# Altium project STEERING_WHEEL_SWITCHES.PrjPcb
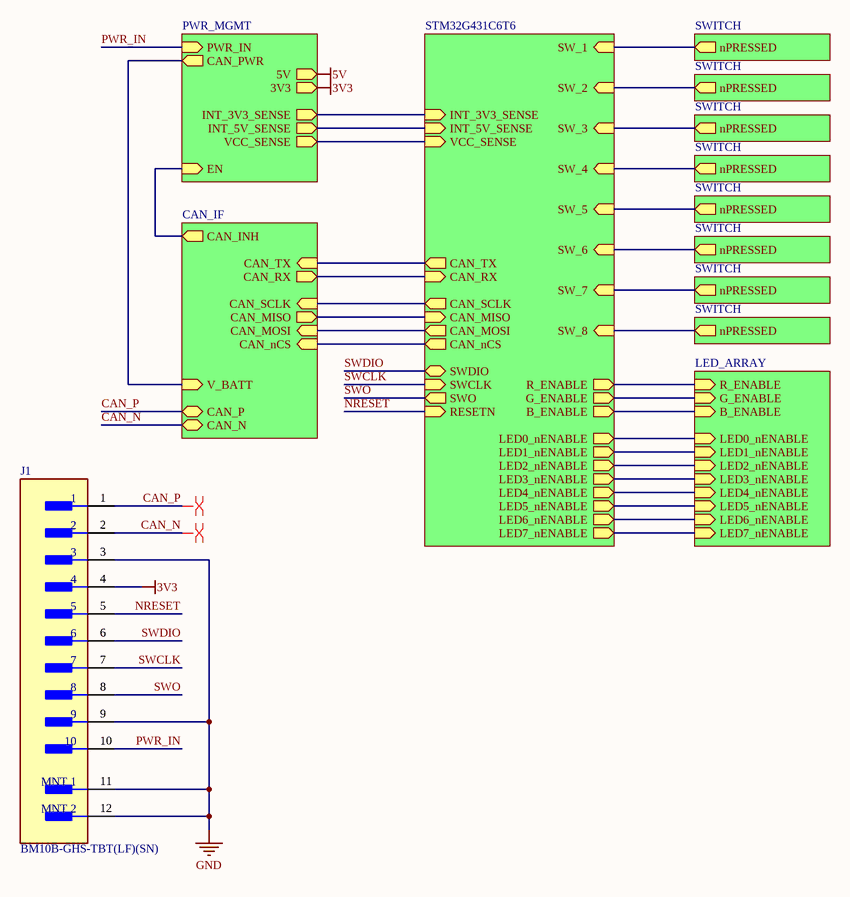
[diagram p0: STEERING_WHEEL_SWITCHES.SchDoc]
2 sheets, 20 parts. Net scope: hierarchical (ports join the sheet entries above them; power ports are global).
Board files: SWS_LEFT.PcbDoc, SWS_RIGHT.PcbDoc
Sheets:
  STEERING_WHEEL_SWITCHES.SchDoc
    PWR_MGMT = PWR_MGMT.SchDoc

## Sheet STEERING_WHEEL_SWITCHES.SchDoc
size A4; SheetNumber: 1; SheetTotal: 6

### Parts
J1  BM10B-GHS-TBT(LF)(SN)  [FP-BM10B-GHS-TBT_LF_SN-MFG]

### Sub-sheets
CAN_IF = CAN_IF (file not in this document): CAN_TX (in), CAN_RX (out), CAN_SCLK (in), CAN_MISO (out), CAN_MOSI (in), CAN_nCS (in), CAN_INH (out), CAN_P (bidir), CAN_N (bidir), V_BATT (in)
LED_ARRAY = LED_ARRAY (file not in this document): R_ENABLE (in), G_ENABLE (in), B_ENABLE (in), LED0_nENABLE (in), LED1_nENABLE (in), LED2_nENABLE (in), LED3_nENABLE (in), LED4_nENABLE (in), LED5_nENABLE (in), LED6_nENABLE (in), LED7_nENABLE (in)
MCU = STM32G431C6T6 (file not in this document): SW_1 (in), SW_2 (in), SW_3 (in), SW_4 (in), SW_5 (in), SW_6 (in), SW_7 (in), SW_8 (in), INT_3V3_SENSE (in), INT_5V_SENSE (in), CAN_TX (out), CAN_RX (in), CAN_SCLK (out), CAN_MISO (in), CAN_MOSI (out), CAN_nCS (out), SWDIO (bidir), SWCLK (in), SWO (out), RESETN (in), R_ENABLE (out), G_ENABLE (out), B_ENABLE (out), LED0_nENABLE (out), LED1_nENABLE (out), LED2_nENABLE (out), LED3_nENABLE (out), LED4_nENABLE (out), LED5_nENABLE (out), LED6_nENABLE (out), LED7_nENABLE (out), VCC_SENSE (in)
PWR_MGMT = PWR_MGMT: PWR_IN (in), EN (in), 5V (out), 3V3 (out), INT_3V3_SENSE (out), INT_5V_SENSE (out), CAN_PWR (out), VCC_SENSE (out)
SWITCH = SWITCH (file not in this document): nPRESSED (out)
SWITCH = SWITCH (file not in this document): nPRESSED (out)
SWITCH = SWITCH (file not in this document): nPRESSED (out)
SWITCH = SWITCH (file not in this document): nPRESSED (out)
SWITCH = SWITCH (file not in this document): nPRESSED (out)
SWITCH = SWITCH (file not in this document): nPRESSED (out)
SWITCH = SWITCH (file not in this document): nPRESSED (out)
SWITCH = SWITCH (file not in this document): nPRESSED (out)

### Nets
3V3: J1.4 ; sheet PWR_MGMT/3V3
GND: J1.3 J1.9 J1.11(MNT_1) J1.12(MNT_2)
CAN_N: J1.2 ; sheet CAN_IF/CAN_N
CAN_P: J1.1 ; sheet CAN_IF/CAN_P
NRESET: J1.5 ; sheet MCU/RESETN
PWR_IN: J1.10 ; sheet PWR_MGMT/PWR_IN
SWCLK: J1.7 ; sheet MCU/SWCLK
SWDIO: J1.6 ; sheet MCU/SWDIO
SWO: J1.8 ; sheet MCU/SWO
V_BATT: sheet PWR_MGMT/CAN_PWR, sheet CAN_IF/V_BATT
NetR1_1: sheet PWR_MGMT/VCC_SENSE, sheet MCU/VCC_SENSE
NetR7_1: sheet PWR_MGMT/INT_3V3_SENSE, sheet MCU/INT_3V3_SENSE
NetR11_1: sheet PWR_MGMT/INT_5V_SENSE, sheet MCU/INT_5V_SENSE
NetR12_2: sheet PWR_MGMT/EN, sheet CAN_IF/CAN_INH
(unnamed): sheet MCU/SW_1, sheet SWITCH/nPRESSED
(unnamed): sheet MCU/SW_2, sheet SWITCH/nPRESSED
(unnamed): sheet MCU/SW_3, sheet SWITCH/nPRESSED
(unnamed): sheet MCU/SW_4, sheet SWITCH/nPRESSED
(unnamed): sheet MCU/SW_5, sheet SWITCH/nPRESSED
(unnamed): sheet MCU/SW_6, sheet SWITCH/nPRESSED
(unnamed): sheet MCU/SW_7, sheet SWITCH/nPRESSED
(unnamed): sheet MCU/SW_8, sheet SWITCH/nPRESSED
(unnamed): sheet MCU/CAN_TX, sheet CAN_IF/CAN_TX
(unnamed): sheet MCU/CAN_RX, sheet CAN_IF/CAN_RX
(unnamed): sheet MCU/CAN_SCLK, sheet CAN_IF/CAN_SCLK
(unnamed): sheet MCU/CAN_MISO, sheet CAN_IF/CAN_MISO
(unnamed): sheet MCU/CAN_MOSI, sheet CAN_IF/CAN_MOSI
(unnamed): sheet MCU/CAN_nCS, sheet CAN_IF/CAN_nCS
(unnamed): sheet MCU/R_ENABLE, sheet LED_ARRAY/R_ENABLE
(unnamed): sheet MCU/G_ENABLE, sheet LED_ARRAY/G_ENABLE
(unnamed): sheet MCU/B_ENABLE, sheet LED_ARRAY/B_ENABLE
(unnamed): sheet MCU/LED0_nENABLE, sheet LED_ARRAY/LED0_nENABLE
(unnamed): sheet MCU/LED1_nENABLE, sheet LED_ARRAY/LED1_nENABLE
(unnamed): sheet MCU/LED2_nENABLE, sheet LED_ARRAY/LED2_nENABLE
(unnamed): sheet MCU/LED3_nENABLE, sheet LED_ARRAY/LED3_nENABLE
(unnamed): sheet MCU/LED4_nENABLE, sheet LED_ARRAY/LED4_nENABLE
(unnamed): sheet MCU/LED5_nENABLE, sheet LED_ARRAY/LED5_nENABLE
(unnamed): sheet MCU/LED6_nENABLE, sheet LED_ARRAY/LED6_nENABLE
(unnamed): sheet MCU/LED7_nENABLE, sheet LED_ARRAY/LED7_nENABLE

### Layout directives
differential pair: CAN_N, CAN_P

### Library data of the parts
J1 = CMP-17439-000185-1: Connector Header Surface Mount 10 position 0.049" (1.25mm); Current Rating: 1A; Number of Contacts: 10; Voltage Rating: 50V; Wire/Cable Gauge: 26AWG; Connector Type: Male Pin; Packaging: Tape and Reel; Lead Free: Lead Free; Contact Material: Bronze; Termination: SMD/SMT; Orientation: Straight; Package Quantity: 1; Color: Natural; Housing Material: Nylon; Mount: Surface Mount; Fastening Type: Latch; REACH SVHC: No SVHC; Number of Rows: 1; Series: GH; Voltage Rating (AC): 50V; Number of Positions: 10; Min Operating Temperature: -25°C; Housing Color: Natural; Max Operating Temperature: 85°C; Contact Plating: Tin; Pitch: 1.25mm

## Sheet PWR_MGMT.SchDoc
size A4; SheetNumber: 3; SheetTotal: 6
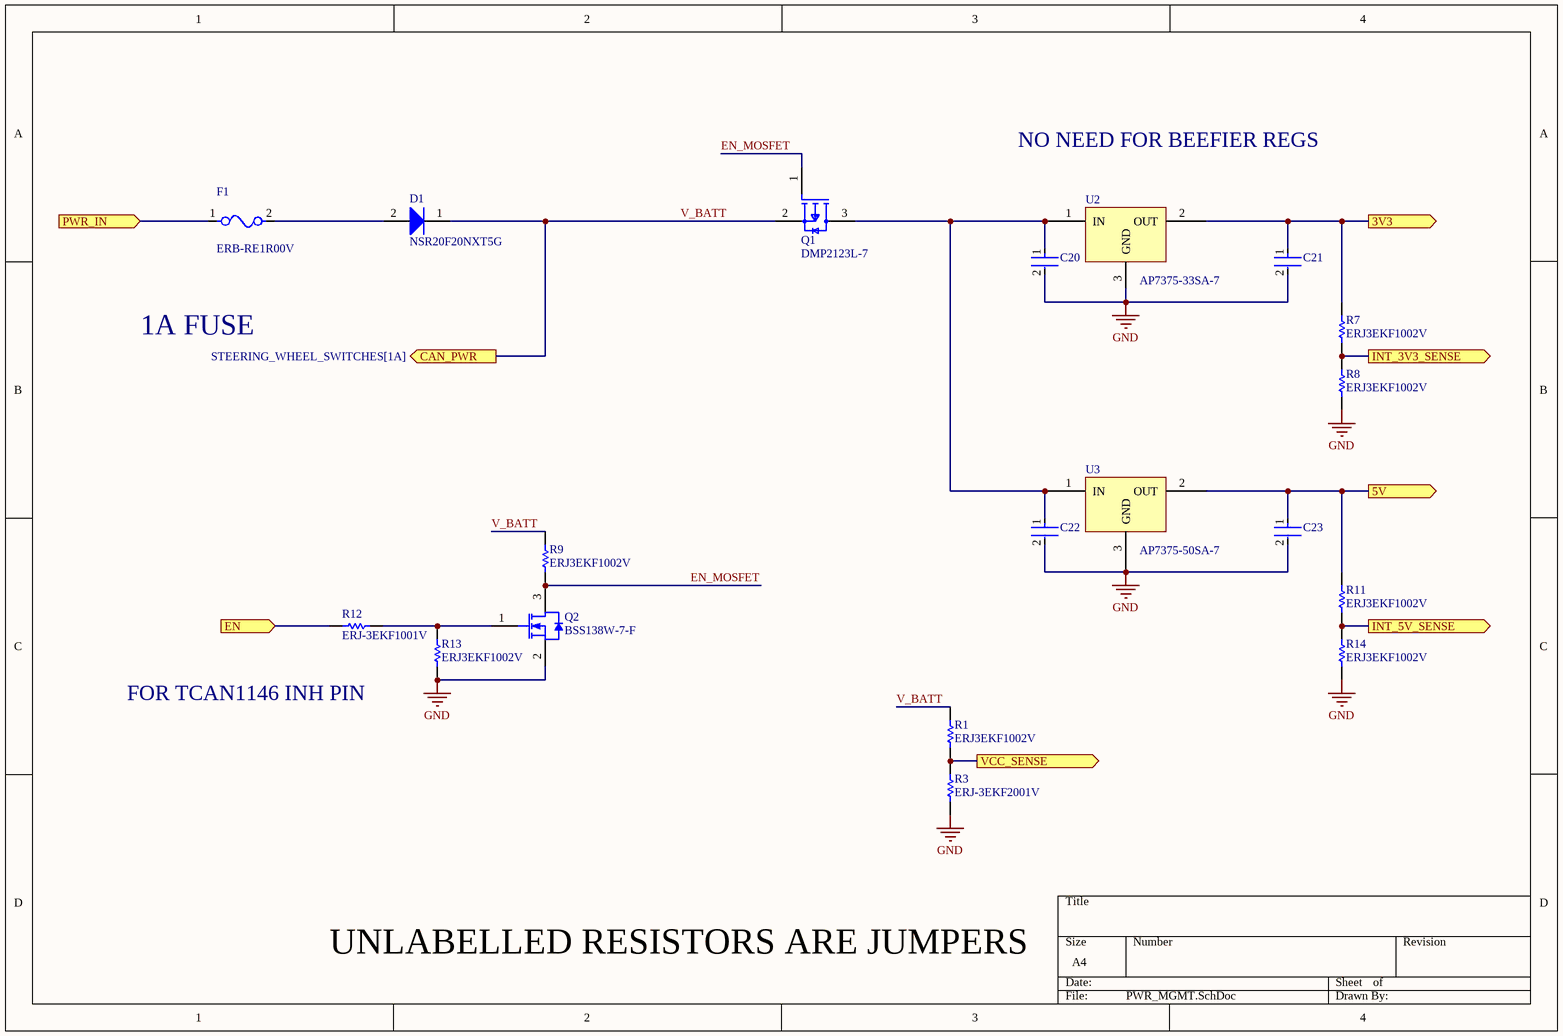
[diagram p1: PWR_MGMT.SchDoc]

### Parts
C20  GRM188R61E106KA73D  [FP-GRM188-0_2-IPC_A]  (value not drawn)
C21  GRM188R61E106KA73D  [FP-GRM188-0_2-IPC_A]  (value not drawn)
C22  GRM188R61E106KA73D  [FP-GRM188-0_2-IPC_A]  (value not drawn)
C23  GRM188R61E106KA73D  [FP-GRM188-0_2-IPC_A]  (value not drawn)
D1  NSR20F20NXT5G  [ONSC-DSN-2-512AB-01_V]
F1  ERB-RE1R00V  [FP-ERBRE-MFG]
Q1  DMP2123L-7  [FP-SOT23-MFG]
Q2  BSS138W-7-F  [DIOD-SOT323-3_V]
R1  ERJ3EKF1002V  [RESC1609X55X30LL15T15]
R3  ERJ-3EKF2001V  [RESC1608X55X30ML15T15]
R7  ERJ3EKF1002V  [RESC1609X55X30LL15T15]
R8  ERJ3EKF1002V  [RESC1609X55X30LL15T15]
R9  ERJ3EKF1002V  [RESC1609X55X30LL15T15]
R11  ERJ3EKF1002V  [RESC1609X55X30LL15T15]
R12  ERJ-3EKF1001V  [RESC1608X55X30LL15T15]
R13  ERJ3EKF1002V  [RESC1609X55X30LL15T15]
R14  ERJ3EKF1002V  [RESC1609X55X30LL15T15]
U2  AP7375-33SA-7  [SOT90P285X110-3N]
U3  AP7375-50SA-7  [AP7375-50SA-7-Footprint-1]

### Ports
3V3 (out, see STEERING_WHEEL_SWITCHES[2A]), 5V (out, see STEERING_WHEEL_SWITCHES[2A]), CAN_PWR (out, see STEERING_WHEEL_SWITCHES[1A]), EN (in, see STEERING_WHEEL_SWITCHES[1A]), INT_3V3_SENSE (out, see STEERING_WHEEL_SWITCHES[2A], STM32G431C6T6[5A]), INT_5V_SENSE (out, see STEERING_WHEEL_SWITCHES[2A], STM32G431C6T6[5A]), PWR_IN (in, see STEERING_WHEEL_SWITCHES[1A]), VCC_SENSE (out)

### Nets
3V3: C21.1 R7.2 U2.2(OUT) ; port 3V3
5V: C23.1 R11.2 U3.2(OUT) ; port 5V
GND: C20.2 C21.2 C22.2 C23.2 Q2.2(S) R3.1 R8.1 R13.1 R14.2 U2.3(GND) U3.3(GND)
EN_MOSFET: Q1.1(G) Q2.3(D) R9.1
PWR_IN: F1.1 ; port PWR_IN
V_BATT: D1.1(K) Q1.2(S) R1.2 R9.2 ; port CAN_PWR
NetC20_1: C20.1 C22.1 Q1.3(D) U2.1(IN) U3.1(IN)
NetD1_2: D1.2(A) F1.2
NetQ2_1: Q2.1(G) R12.1 R13.2
NetR1_1: R1.1 R3.2 ; port VCC_SENSE
NetR7_1: R7.1 R8.2 ; port INT_3V3_SENSE
NetR11_1: R11.1 R14.1 ; port INT_5V_SENSE
NetR12_2: R12.2 ; port EN

### Notes on the sheet
- NO NEED FOR BEEFIER REGS
- 1A FUSE
- FOR TCAN1146 INH PIN
- UNLABELLED RESISTORS ARE JUMPERS

### Library data of the parts
C20-C23 = CMP-06035-045268-1: Chip Multilayer Ceramic Capacitors for General Purpose, 0603, 10uF, X5R, 15%, 10%, 25V; Case/Package: 0603
D1 = CMP-1055-00234-1: Schottky Barrier Diode, 2-Pin DSN, Pb-Free, Tape and Reel; Manufacturer: On Semiconductor; Configuration: Single; IFSM Max (A): 28; ComponentLink1URL: http://www.onsemi.com/; ComponentLink3URL: http://www.onsemi.cn/pub_link/Collateral/152AB.PDF; PackageReference: DSN-2-512AB-01; RoHS: TRUE; ComponentLink2URL: http://www.onsemi.com/pub_link/Collateral/NSR20F20-D.PDF; ComponentLink2Description: Datasheet; PackageDescription: 2-Pin Micro Molded Package, Body 1.6 x 0.8 mm; PartNumber: NSR20F20NXT5G; ComponentLink3Description: Package Specification; DatasheetVersion: Rev. 2; PackageVersion: Rev. B, 01/2011; Mounting Technology: Surface Mount; Packing: Tape and Reel; ComponentLink1Description: Manufacturer URL
F1 = CMP-00287-21220537-1: ERB-RE1R00V Fuse Chip Fast Acting 1A 32V SMD Solder Pad 0603 1.6 X 0.8 X 0.54mm T/R UL/cUL; Resistance: 125mΩ; Approvals: UL; Body Material: Alumina; Number of Pins: 2; RoHS: Compliant; Length: 1.6mm; Max Voltage Rating (DC): 32V; REACH SVHC: No SVHC; Case Code (Imperial): 0603; Mount: Surface Mount; Voltage Rating: 32V; Case Code (Metric): 1608; Current Rating: 1A; Width: 800µm; Min Operating Temperature: -40°C; Voltage Rating (DC): 32V; Height: 640µm; Current: 1A; Lead Free: Lead Free; Packaging: Cut Tape; Lifecycle Status: Production; Case/Package: 0603; Max Operating Temperature: 125°C; Fuse Current: 1A; Radiation Hardening: No; Depth: 800µm
Q1 = CMP-00461-12441635-1: DMP2123L-7 P-Channel 20 V 72 mO Surface Mount Enhancement Mode Mosfet - SOT-23; Number of Channels: 1; Power Dissipation: 1.4W; Gate to Source Voltage (Vgs): 12V; Rds On Max: 72mΩ; Drain to Source Breakdown Voltage: -20V; Turn-On Delay Time: 12ns; Turn-Off Delay Time: 38ns; Max Junction Temperature (Tj): 150°C; Element Configuration: Single; Drain to Source Resistance: 51mΩ; Continuous Drain Current (ID): -3A; Fall Time: 41ns; Rise Time: 20ns; Input Capacitance: 443pF; Weight: 7.994566mg; Number of Pins: 3; Schedule B: 8541290080, 8541290080; Max Power Dissipation: 1.4W; REACH SVHC: No SVHC; Mount: Surface Mount; Radiation Hardening: No; Max Operating Temperature: 150°C; Height: 1.1mm; NexarPartId: 12441635; Resistance: 72mΩ; Min Operating Temperature: -55°C; Lead Free: Lead Free; Width: 1.3mm; Drain to Source Voltage (Vdss): -20V; Case/Package: SOT-23-3; Length: 2.9mm; Number of Elements: 1; RoHS: Compliant
Q2 = CMP-2000-05968-1: N-Channel Enhancement Mode Mosfet, 50 V, 200 mA, -55 to 150 degC, 6-Pin SOT-323, RoHS, Tape and Reel; Typical Turn-Off Delay Time: 20ns; Number of Channels: 1Channel; Type: EnhancementModeFieldEffectTransistor; Brand: DiodesIncorporated; Vds - Drain-Source Breakdown Voltage: 75V; Vgs - Gate-Source Voltage: 20V; Rds On - Drain-Source Resistance: 1.4Ohms; Transistor Type: 1N-Channel; Configuration: Single; Unit Weight: 0.000212oz; Pd - Power Dissipation: 200mW; Id - Continuous Drain Current: 200mA; Forward Transconductance - Min: 0.1S; Manufacturer URL: http://www.diodes.com/; Series: BSS138; Package Description: 3-Pin Small Outline Transistor, Body 2 x 1.25 mm, Pitch 0.65 mm; Mounting Technology: SurfaceMount; Product Category: MOSFET; RoHS: True; Maximum Operating Temperature: +150C; Height: 1mm; Length: 2.2mm; Technology: Si; Width: 1.35mm; Datasheet URL: http://www.diodes.com/_files/datasheets/ds30206.pdf; Manufacturer: DiodesIncorporated; Package / Case: SOT-323-3; Typical Turn-On Delay Time: 20ns; Transistor Polarity: N-Channel; Factory Pack Quantity: 3000; Packaging: Reel; Product: MOSFETSmallSignal; Datasheet Version: Rev. 11-2, 09/2013; Package Reference: SOT323; Minimum Operating Temperature: -55C; Mounting Style: SMD/SMT; Channel Mode: Enhancement
R1 R7-R9 R11 R13 R14 = CMP-1012-00623-3: Chip Resistor, 10 KOhm, +/- 1%, 0.1 W, -55 to 155 degC, 0603 (1608 Metric), RoHS, Tape and Reel; Manufacturer: Panasonic; Voltage Rating: 75V; Case\/Package: 0603; Power Rating: 100mW; Resistance: 10KOhm; Temperature Coefficient: 100ppm\/degreesC; Number of Pins: 2; Package Reference: 603; Depth: 0.8mm; Mount: SurfaceMount; Package Description: 2-Pin Surface Mount Device, Body 1.6 x 0.85 mm; Datasheet Version: 02/2017; Length: 1.6mm; Lead Free: LeadFree; Height: 0.45mm; Number of Terminations: 2; Max Power Dissipation: 100mW; Min Operating Temperature: -55degC; Datasheet URL: https://industrial.panasonic.com/cdbs/www-data/pdf/RDA0000/AOA0000C304.pdf; Termination: SMD/SMT; Case Code (Metric): 1608; Case Code (Imperial): 0603; Tolerance: 1%; Max Operating Temperature: 155degC; RoHSCompliant: true; Voltage Rating (DC): 75V; Radiation Hardening: No; Packaging: TapeandReel; Composition: ThickFilm; Mounting Technology: SurfaceMount; Manufacturer URL: http://www.panasonic.com/; Width: 0.031inch; REACH SVHC: NoSVHC; Contact Plating: Tin; Military Standard: Not; Package Quantity: 1
R3 = CMP-2000-00317-1: Manufacturer: Panasonic; Part Number: ERJ-3EKF2001V
R12 = CMP-2000-00180-1: Manufacturer: Panasonic; Part Number: ERJ-3EKF1001V
U2 = CMP-019-00039-1: LDO Regulator Pos 3.3V 0.3A 3-Pin SOT-23 T/R
U3 = CMP-019-00041-1: Ldo Cmos Lowcurr SOT23 T&r 3K

## Nets that join several sheets
3V3: STEERING_WHEEL_SWITCHES (J1.4), PWR_MGMT (C21.1 R7.2 U2.2)
GND: STEERING_WHEEL_SWITCHES (J1.3 J1.9 J1.11 J1.12), PWR_MGMT (11 pins)
PWR_IN: STEERING_WHEEL_SWITCHES (J1.10), PWR_MGMT (F1.1)